# Altium schematic sheet STM32F407VGT6.SchDoc
size A3
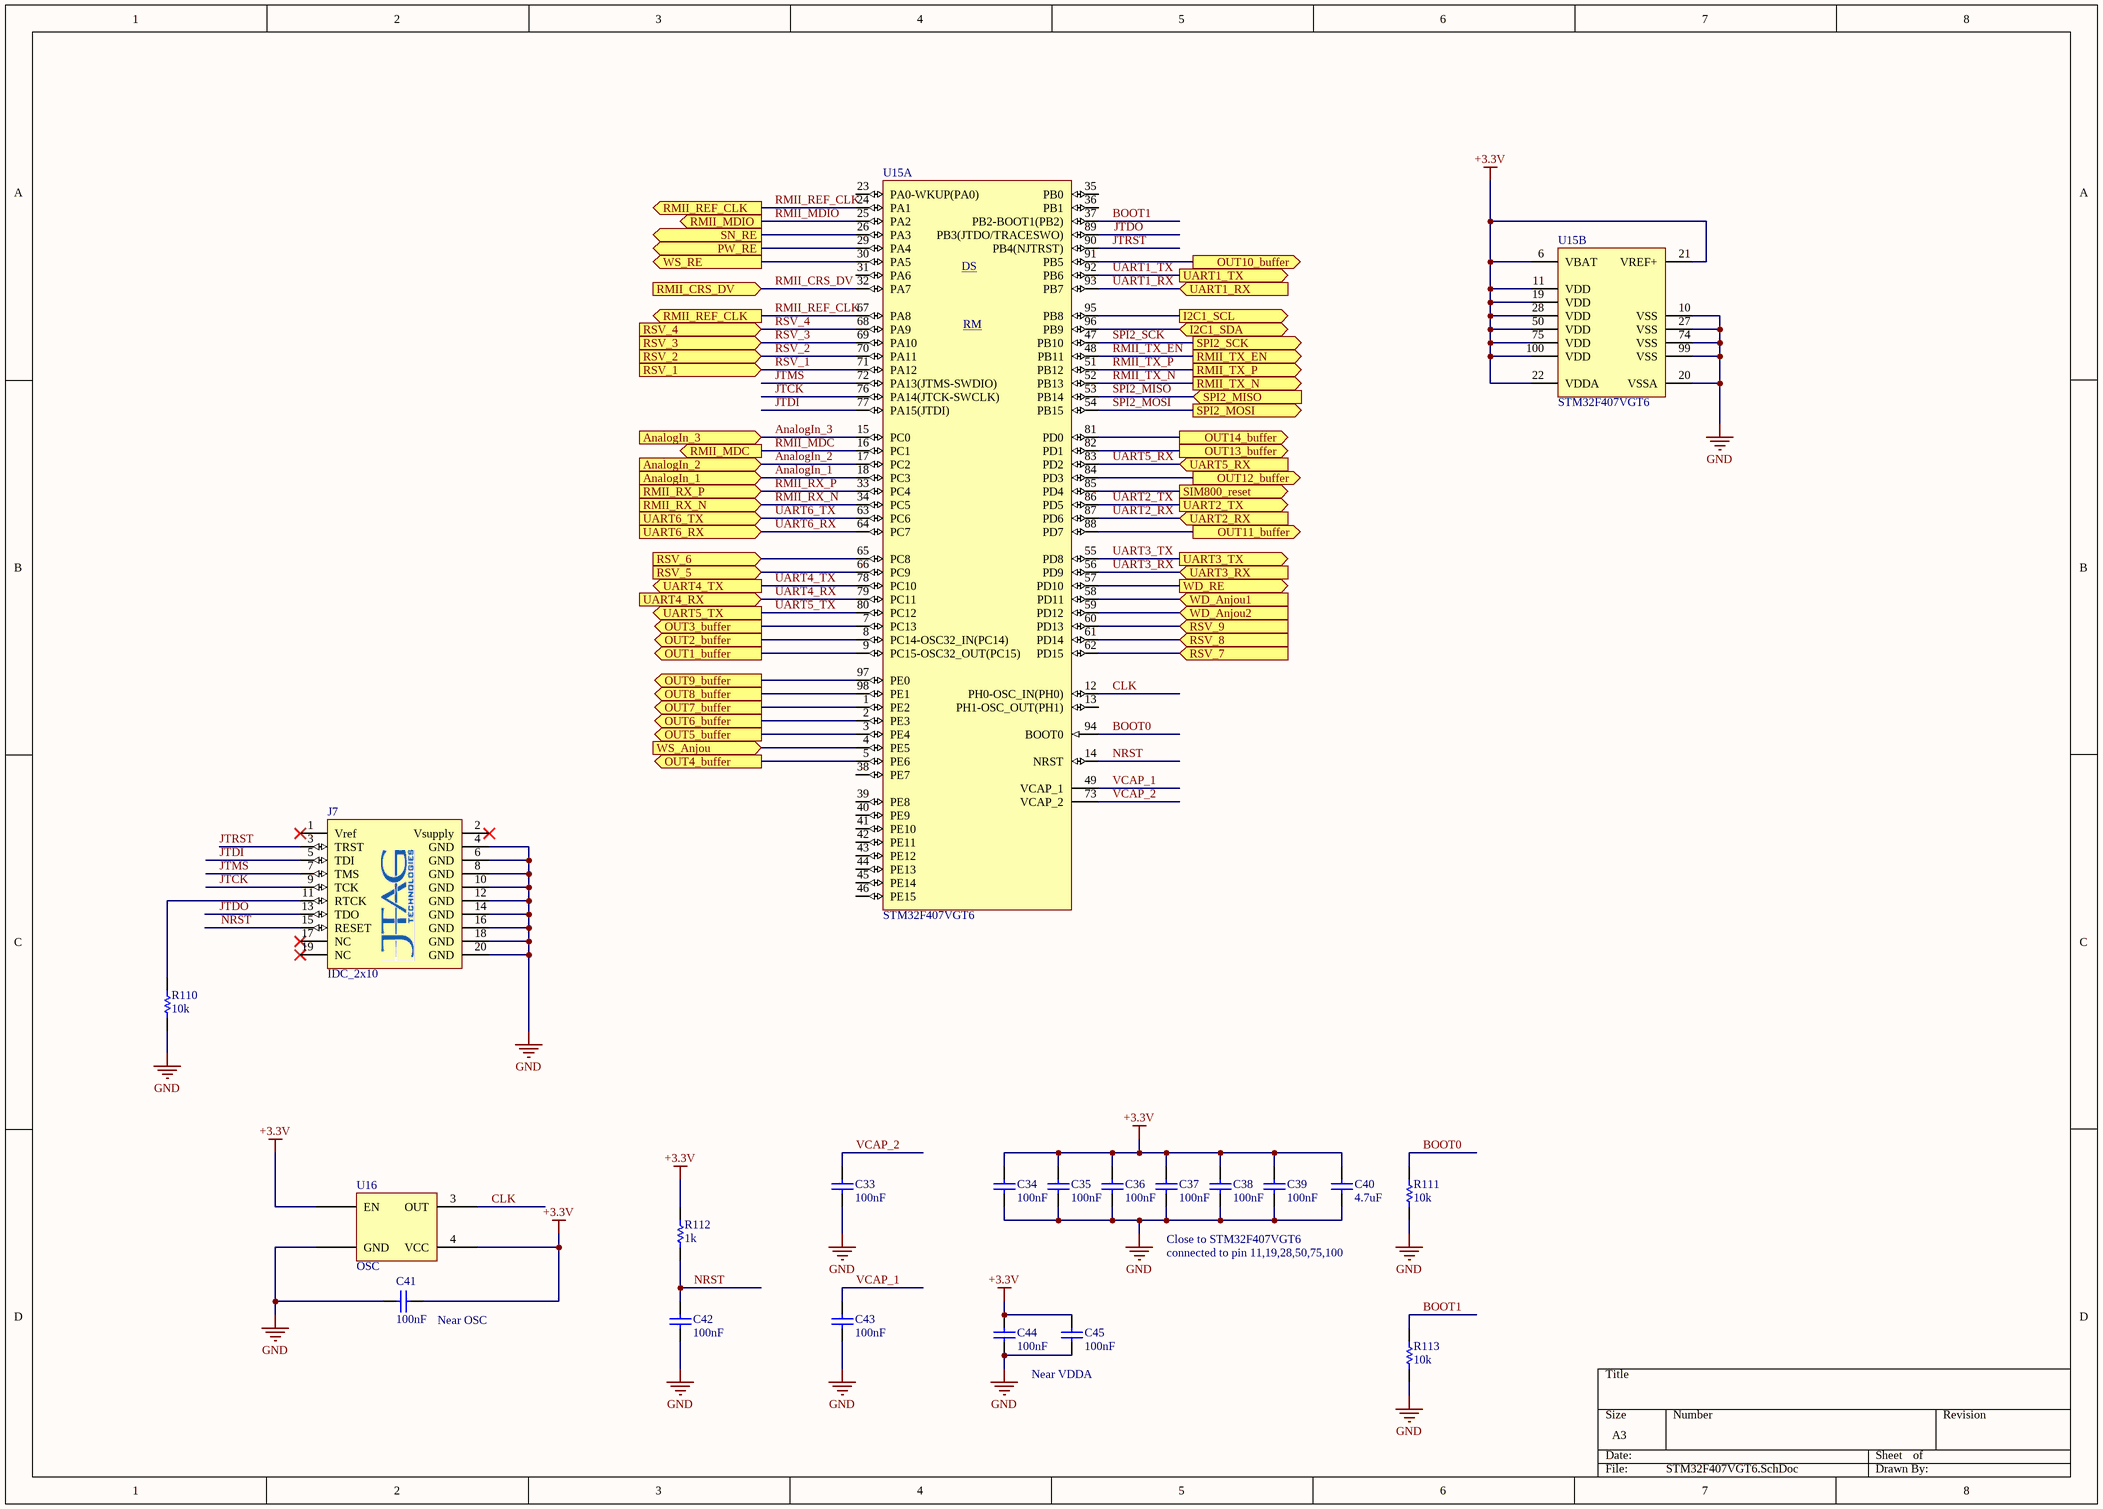
[diagram p0: STM32F407VGT6.SchDoc]

## Parts
C33  value 100nF  [C-805]  (hidden comment: C-805)
C34  value 100nF  [C-805]  (hidden comment: C-805)
C35  value 100nF  [C-805]  (hidden comment: C-805)
C36  value 100nF  [C-805]  (hidden comment: C-805)
C37  value 100nF  [C-805]  (hidden comment: C-805)
C38  value 100nF  [C-805]  (hidden comment: C-805)
C39  value 100nF  [C-805]  (hidden comment: C-805)
C40  value 4.7uF  [C-1206]  (hidden comment: C-1206)
C41  value 100nF  [C-805]  (hidden comment: C-805)
C42  value 100nF  [C-805]  (hidden comment: C-805)
C43  value 100nF  [C-805]  (hidden comment: C-805)
C44  value 100nF  [C-805]  (hidden comment: C-805)
C45  value 100nF  [C-805]  (hidden comment: C-805)
J7  IDC_2x10  [IDC2.54-V20D]
R110  value 10k  [R-805]  (hidden comment: R-805)
R111  value 10k  [R-805]  (hidden comment: R-805)
R112  value 1k  [R-805]  (hidden comment: R-805)
R113  value 10k  [R-805]  (hidden comment: R-805)
U15  STM32F407VGT6  [STM-LQFP100_N]  (parts A,B of 2)
U16  OSC  [OSC]

## Ports
AnalogIn_1 (in), AnalogIn_2 (in), AnalogIn_3 (in), I2C1_SCL (out), I2C1_SDA (bidir), OUT1_buffer (out), OUT2_buffer (out), OUT3_buffer (out), OUT4_buffer (out), OUT5_buffer (out), OUT6_buffer (out), OUT7_buffer (out), OUT8_buffer (out), OUT9_buffer (out), OUT10_buffer (out), OUT11_buffer (out), OUT12_buffer (out), OUT13_buffer (out), OUT14_buffer (out), PW_RE (out), RMII_CRS_DV (in), RMII_MDC (out), RMII_MDIO (out), RMII_REF_CLK (out), RMII_RX_N (in), RMII_RX_P (in), RMII_TX_EN (out), RMII_TX_N (out), RMII_TX_P (out), RSV_1 (in), RSV_2 (in), RSV_3 (in), RSV_4 (in), RSV_5 (in), RSV_6 (in), RSV_7 (in), RSV_8 (in), RSV_9 (in), SIM800_reset (out), SN_RE (out), SPI2_MISO (in), SPI2_MOSI (out), SPI2_SCK (out), UART1_RX (in), UART1_TX (out), UART2_RX (in), UART2_TX (out), UART3_RX (in), UART3_TX (out), UART4_RX (in), UART4_TX (out), UART5_RX (in), UART5_TX (out), UART6_RX (in), UART6_TX (in), WD_Anjou1 (in), WD_Anjou2 (in), WD_RE (out), WS_Anjou (in), WS_RE (out)

## Nets
+3.3V: C34.1 C35.1 C36.1 C37.1 C38.1 C39.1 C40.2 C41.1 C44.1 C45.1 R112.1 U15.6(VBAT) U15.11(VDD) U15.19(VDD) U15.21(VREF+) U15.22(VDDA) U15.28(VDD) U15.50(VDD) U15.75(VDD) U15.100(VDD) U16.1(EN) U16.4(VCC)
GND: C33.2 C34.2 C35.2 C36.2 C37.2 C38.2 C39.2 C40.1 C41.2 C42.2 C43.2 C44.2 C45.2 J7.4(GND) J7.6(GND) J7.8(GND) J7.10(GND) J7.12(GND) J7.14(GND) J7.16(GND) J7.18(GND) J7.20(GND) R110.1 R111.2 R113.2 U15.10(VSS) U15.20(VSSA) U15.27(VSS) U15.74(VSS) U15.99(VSS) U16.2(GND)
AnalogIn_1: U15.18(PC3) ; port AnalogIn_1
AnalogIn_2: U15.17(PC2) ; port AnalogIn_2
AnalogIn_3: U15.15(PC0) ; port AnalogIn_3
BOOT0: R111.1 U15.94(BOOT0)
BOOT1: R113.1 U15.37(PB2-BOOT1(PB2))
CLK: U15.12(PH0-OSC_IN(PH0)) U16.3(OUT)
I2C1_SCL: U15.95(PB8) ; port I2C1_SCL
I2C1_SDA: U15.96(PB9) ; port I2C1_SDA
JTCK: J7.9(TCK) U15.76(PA14(JTCK-SWCLK))
JTDI: J7.5(TDI) U15.77(PA15(JTDI))
JTDO: J7.13(TDO) U15.89(PB3(JTDO/TRACESWO))
JTMS: J7.7(TMS) U15.72(PA13(JTMS-SWDIO))
JTRST: J7.3(TRST) U15.90(PB4(NJTRST))
NRST: C42.1 J7.15(RESET) R112.2 U15.14(NRST)
OUT1_buffer: U15.9(PC15-OSC32_OUT(PC15)) ; port OUT1_buffer
OUT2_buffer: U15.8(PC14-OSC32_IN(PC14)) ; port OUT2_buffer
OUT3_buffer: U15.7(PC13) ; port OUT3_buffer
OUT4_buffer: U15.5(PE6) ; port OUT4_buffer
OUT5_buffer: U15.3(PE4) ; port OUT5_buffer
OUT6_buffer: U15.2(PE3) ; port OUT6_buffer
OUT7_buffer: U15.1(PE2) ; port OUT7_buffer
OUT8_buffer: U15.98(PE1) ; port OUT8_buffer
OUT9_buffer: U15.97(PE0) ; port OUT9_buffer
OUT10_buffer: U15.91(PB5) ; port OUT10_buffer
OUT11_buffer: U15.88(PD7) ; port OUT11_buffer
OUT12_buffer: U15.84(PD3) ; port OUT12_buffer
OUT13_buffer: U15.82(PD1) ; port OUT13_buffer
OUT14_buffer: U15.81(PD0) ; port OUT14_buffer
PW_RE: U15.29(PA4) ; port PW_RE
RMII_CRS_DV: U15.32(PA7) ; port RMII_CRS_DV
RMII_MDC: U15.16(PC1) ; port RMII_MDC
RMII_MDIO: U15.25(PA2) ; port RMII_MDIO
RMII_REF_CLK: U15.24(PA1) U15.67(PA8) ; port RMII_REF_CLK
RMII_RX_N: U15.34(PC5) ; port RMII_RX_N
RMII_RX_P: U15.33(PC4) ; port RMII_RX_P
RMII_TX_EN: U15.48(PB11) ; port RMII_TX_EN
RMII_TX_N: U15.52(PB13) ; port RMII_TX_N
RMII_TX_P: U15.51(PB12) ; port RMII_TX_P
RSV_1: U15.71(PA12) ; port RSV_1
RSV_2: U15.70(PA11) ; port RSV_2
RSV_3: U15.69(PA10) ; port RSV_3
RSV_4: U15.68(PA9) ; port RSV_4
RSV_5: U15.66(PC9) ; port RSV_5
RSV_6: U15.65(PC8) ; port RSV_6
RSV_7: U15.62(PD15) ; port RSV_7
RSV_8: U15.61(PD14) ; port RSV_8
RSV_9: U15.60(PD13) ; port RSV_9
SIM800_reset: U15.85(PD4) ; port SIM800_reset
SN_RE: U15.26(PA3) ; port SN_RE
SPI2_MISO: U15.53(PB14) ; port SPI2_MISO
SPI2_MOSI: U15.54(PB15) ; port SPI2_MOSI
SPI2_SCK: U15.47(PB10) ; port SPI2_SCK
UART1_RX: U15.93(PB7) ; port UART1_RX
UART1_TX: U15.92(PB6) ; port UART1_TX
UART2_RX: U15.87(PD6) ; port UART2_RX
UART2_TX: U15.86(PD5) ; port UART2_TX
UART3_RX: U15.56(PD9) ; port UART3_RX
UART3_TX: U15.55(PD8) ; port UART3_TX
UART4_RX: U15.79(PC11) ; port UART4_RX
UART4_TX: U15.78(PC10) ; port UART4_TX
UART5_RX: U15.83(PD2) ; port UART5_RX
UART5_TX: U15.80(PC12) ; port UART5_TX
UART6_RX: U15.64(PC7) ; port UART6_RX
UART6_TX: U15.63(PC6) ; port UART6_TX
VCAP_1: C43.1 U15.49(VCAP_1)
VCAP_2: C33.1 U15.73(VCAP_2)
WD_Anjou1: U15.58(PD11) ; port WD_Anjou1
WD_Anjou2: U15.59(PD12) ; port WD_Anjou2
WD_RE: U15.57(PD10) ; port WD_RE
WS_Anjou: U15.4(PE5) ; port WS_Anjou
WS_RE: U15.30(PA5) ; port WS_RE
NetJ7_11: J7.11(RTCK) R110.2

Not connected (* = marked no-connect by the designer): J7 1(Vref)* 2(Vsupply)* 17(NC)* 19(NC)*; U15 13(PH1-OSC_OUT(PH1)) 23(PA0-WKUP(PA0)) 31(PA6) 35(PB0) 36(PB1) 38(PE7) 39(PE8) 40(PE9) 41(PE10) 42(PE11) 43(PE12) 44(PE13) 45(PE14) 46(PE15)

## Notes on the sheet
- Close to STM32F407VGT6
- connected to pin 11,19,28,50,75,100
- (near C41) Near OSC
- Near VDDA
- (in symbol STM32F407VGT6, part A) DS; RM

## Library data of the parts
C33-C39 C41-C45 = C-805: Capacitor; Published: 8-Jun-2000; LatestRevisionDate: 29-May-2009; LatestRevisionNote: IPC-7351 Footprint Added.; PackageReference: C1206; Publisher: Altium Limited; PackageDescription: Chip Capacitor
C40 = C-1206: Capacitor; Published: 8-Jun-2000; LatestRevisionDate: 29-May-2009; LatestRevisionNote: IPC-7351 Footprint Added.; PackageReference: C1206; Publisher: Altium Limited; PackageDescription: Chip Capacitor
J7 = JTAG_JLINK: 20 Pin Standard JTAG Header For ARM JLINK; Company: SJ Libraries; Connector type: IDC2.54-20; designer: Eng. Saeid Jorablo; Max Current: mA; Positions: 20; Revision 1: 7/8/2012: Create Model; Category: Headers; ComponentLink1Description: Datasheet; ComponentLink2Description: Reference; Mounting Technology: Through-Hole; Orientation: Vertical; Pin Count: 20; Publisher: SJ UnLimited; Status: Unreleased; Update: 7/8/2012; HelpURL: http://s3.picofile.com/file/7443264187/Coming_Soon_logo.gif
R110-R113 = R-805: Resistor
U15 = STM32F407VGT6: ARM Cortex-M4 32-bit MCU+FPU, 210 DMIPS, 1024 kB Flash, 192 kB Internal RAM, 82 I/Os, 100-pin LQFP, -40 to 85 degC, Tray; Manufacturer: STMicroelectronics; D/A Converter: 2x12-bit; FLASH Size (Prog) (kB): 1024; I/Os (High Current): 82; Internal RAM Size (kB): 192; Operating Frequency(F) (Processor speed) (MHz): 168; Supply Voltage(Vcc) max (V): 3.6; Supply Voltage(Vcc) min (V): 1.8; DatasheetVersion: Rev. 4; PackageVersion: Rev. 1, 06/2013; PackageReference: LQFP100; PackageDescription: 100-Pin Low Profile Quad Flat Package, 14 x 14 mm Body, 0.5 mm Pitch; Supplier 1: Digi-Key; Supplier Part Number 1: 497-11605-ND; Supplier 2: Farnell; Supplier Part Number 2: 2064368; Supplier 3: Newark; Supplier Part Number 3: 73T2333; Supplier 4: Mouser; Supplier Part Number 4: 511-STM32F407VGT6; Core: ARM Cortex-M4; Packing: Tray; Mounting Technology: Surface Mount; PartNumber: STM32F407VGT6; ComponentLink1Description: Manufacturer URL; ComponentLink1URL: http://www.st.com/web/en/home.html; ComponentLink2Description: Datasheet; ComponentLink2URL: http://www.st.com/st-web-ui/static/active/en/resource/technical/document/datasheet/DM00037051.pdf; ComponentLink3Description: Package Specification; ComponentLink3URL: http://www.st.com/st-web-ui/static/active/en/resource/technical/document/data_brief/DM00071938.pdf